# Altium schematic sheet Mosfets.SchDoc
size A4; SheetNumber: 6; SheetTotal: 6
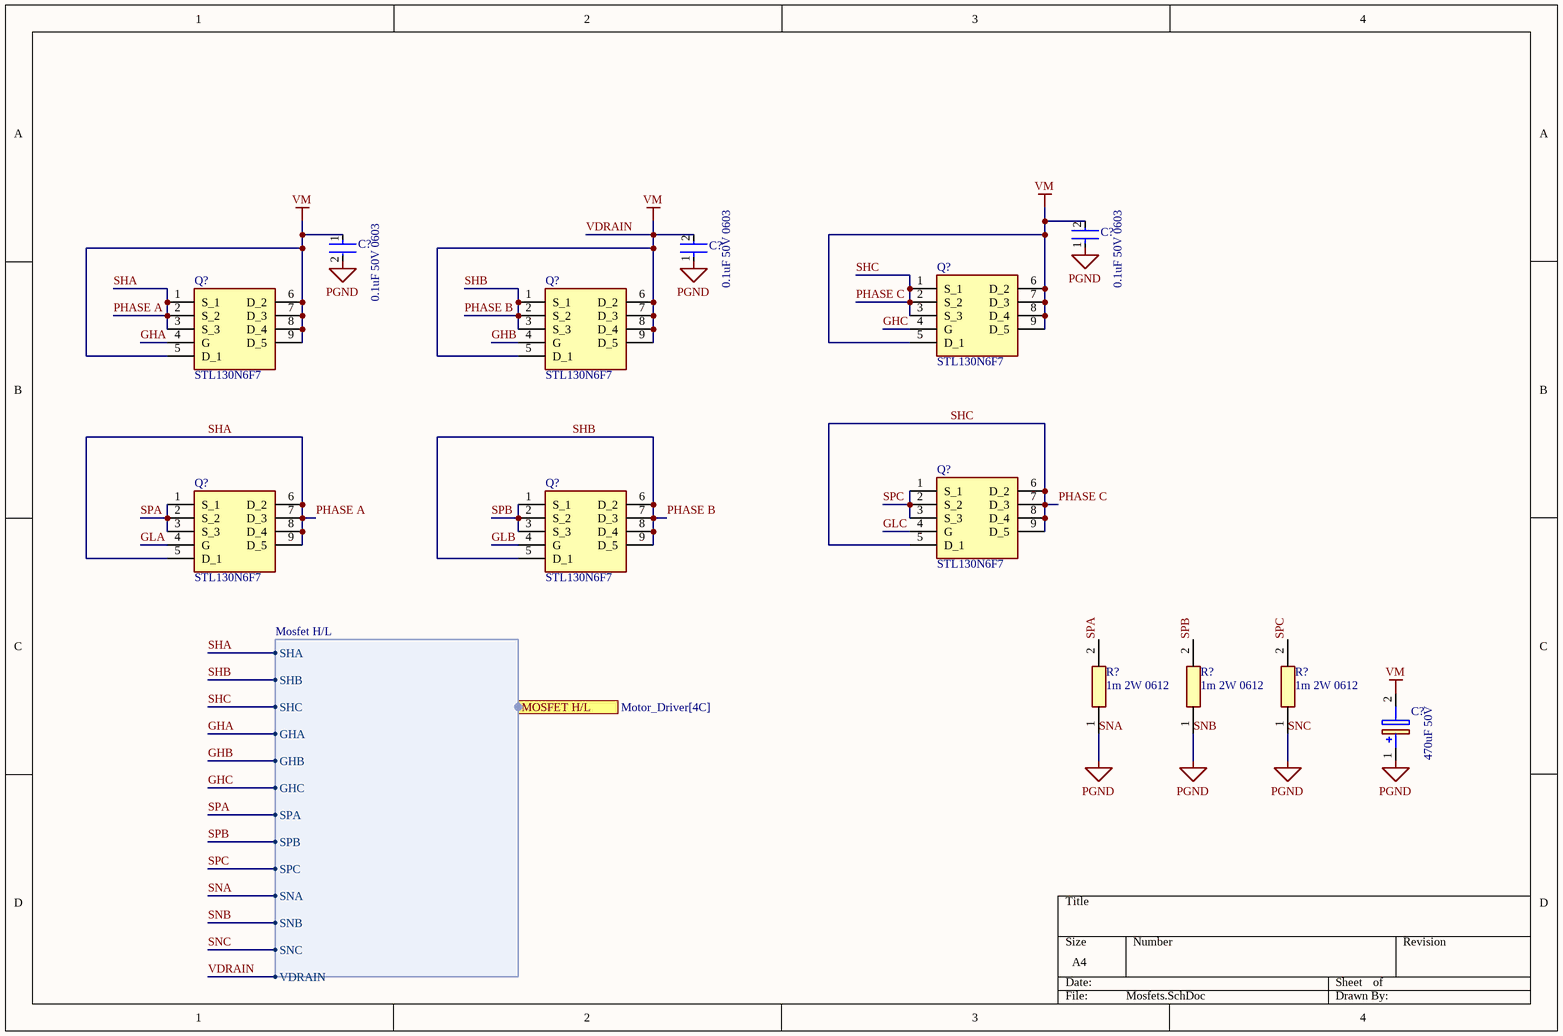
[diagram p0: Mosfets.SchDoc]

## Parts
(Parts that share a designator on the sheet are numbered #1, #2 ... from top to bottom, then left to right.)
C?#1  0.1uF 50V 0603  [FP-0603B104K500CT-IPC_C]
C?#2  0.1uF 50V 0603  [FP-0603B104K500CT-IPC_C]
C?#3  0.1uF 50V 0603  [FP-0603B104K500CT-IPC_C]
C?#4  470uF 50V  [CAPPRD500W65D1000H2200]
Q?#1  STL130N6F7  [FERD20U50DJFTR]
Q?#2  STL130N6F7  [FERD20U50DJFTR]
Q?#3  STL130N6F7  [FERD20U50DJFTR]
Q?#4  STL130N6F7  [FERD20U50DJFTR]
Q?#5  STL130N6F7  [FERD20U50DJFTR]
Q?#6  STL130N6F7  [FERD20U50DJFTR]
R?#1  1m 2W 0612  [WFCP06121L000FE66]
R?#2  1m 2W 0612  [WFCP06121L000FE66]
R?#3  1m 2W 0612  [WFCP06121L000FE66]

## Ports
MOSFET H/L (harness Mosfet H/L, see Motor_Driver[4C])

## Harnesses
Mosfet H/L: SHA, SHB, SHC, GHA, GHB, GHC, SPB, SPA, SPC, SNA, SNB, SNC, VDRAIN

## Nets
SNA: C?#1.2 C?#2.1 C?#3.1 C?#4.1(+) R?#1.1 R?#2.1 R?#3.1 ; port MOSFET H/L.SNA, port MOSFET H/L.SNB, port MOSFET H/L.SNC  [also labelled PGND, SNB, SNC]
VDRAIN: C?#1.1 C?#2.2 C?#3.2 C?#4.2(-) Q?#1.5(D_1) Q?#1.6(D_2) Q?#1.7(D_3) Q?#1.8(D_4) Q?#1.9(D_5) Q?#2.5(D_1) Q?#2.6(D_2) Q?#2.7(D_3) Q?#2.8(D_4) Q?#2.9(D_5) Q?#3.5(D_1) Q?#3.6(D_2) Q?#3.7(D_3) Q?#3.8(D_4) Q?#3.9(D_5) ; port MOSFET H/L.VDRAIN  [also labelled VM]
GHA: Q?#2.4(G) ; port MOSFET H/L.GHA
GHB: Q?#3.4(G) ; port MOSFET H/L.GHB
GHC: Q?#1.4(G) ; port MOSFET H/L.GHC
GLA: Q?#5.4(G)
GLB: Q?#6.4(G)
GLC: Q?#4.4(G)
PHASE A: Q?#2.1(S_1) Q?#2.2(S_2) Q?#2.3(S_3) Q?#5.5(D_1) Q?#5.6(D_2) Q?#5.7(D_3) Q?#5.8(D_4) Q?#5.9(D_5) ; port MOSFET H/L.SHA  [also labelled SHA]
PHASE B: Q?#3.1(S_1) Q?#3.2(S_2) Q?#3.3(S_3) Q?#6.5(D_1) Q?#6.6(D_2) Q?#6.7(D_3) Q?#6.8(D_4) Q?#6.9(D_5) ; port MOSFET H/L.SHB  [also labelled SHB]
PHASE C: Q?#1.1(S_1) Q?#1.2(S_2) Q?#1.3(S_3) Q?#4.5(D_1) Q?#4.6(D_2) Q?#4.7(D_3) Q?#4.8(D_4) Q?#4.9(D_5) ; port MOSFET H/L.SHC  [also labelled SHC]
SPA: Q?#5.1(S_1) Q?#5.2(S_2) Q?#5.3(S_3) R?#1.2 ; port MOSFET H/L.SPA
SPB: Q?#6.1(S_1) Q?#6.2(S_2) Q?#6.3(S_3) R?#2.2 ; port MOSFET H/L.SPB
SPC: Q?#4.1(S_1) Q?#4.2(S_2) Q?#4.3(S_3) R?#3.2 ; port MOSFET H/L.SPC

## Library data of the parts
C?#1-C?#3 = CMP-45632-000007-1: CAP CER 0.1UF 50V X7R 0603; Tolerance: 10%; Capacitance: 100nF; Radiation Hardening: No; Depth: 0.8mm; Length: 1.6mm; Voltage Rating: 50V; Dielectric: X7R; Case/Package: 0603; RoHS Compliant: Yes; Case Code (Metric): 1608; Voltage Rating (DC): 50V; Min Operating Temperature: -55°C; Series: -; Max Operating Temperature: 125°C; Lead Free: Lead Free; Case Code (Imperial): 0603; Packaging: Tape and Reel
C?#4 = ECA-1HM471B: Capacitor Polarised, ECA-1HM471B; Manufacturer_Name: Panasonic; Datasheet Link: http://industrial.panasonic.com/cdbs/www-data/pdf/RDF0000/ABA0000C1218.pdf; Height: 22mm; Manufacturer_Part_Number: ECA-1HM471B; Mouser Part Number: 667-ECA-1HM471B; Mouser Price/Stock: https://www.mouser.co.uk/ProductDetail/Panasonic/ECA-1HM471B?qs=RQTRNQENgbttVw3qXUS4Ew%3D%3D; Arrow Part Number: ECA-1HM471B; Arrow Price/Stock: https://www.arrow.com/en/products/eca-1hm471b/panasonic?utm_currency=USD&region=nac
Q?#1-Q?#6 = STL130N6F7: MOSFET (N-Channel); Manufacturer_Name: STMicroelectronics; Datasheet Link: https://www.st.com/resource/en/datasheet/stl130n6f7.pdf; Height: 1mm; Manufacturer_Part_Number: STL130N6F7; Mouser Part Number: 511-STL130N6F7; Mouser Price/Stock: https://www.mouser.co.uk/ProductDetail/STMicroelectronics/STL130N6F7?qs=bKenfurwlsn66DUeXqgWIw%3D%3D; Arrow Part Number: STL130N6F7; Arrow Price/Stock: https://www.arrow.com/en/products/stl130n6f7/stmicroelectronics?utm_currency=USD&region=nac
R?#1-R?#3 = WFCP06121L000FE66: Resistor; Manufacturer_Name: Vishay; Datasheet Link: https://www.vishay.com/docs/30417/wfcp.pdf; Height: 1mm; Manufacturer_Part_Number: WFCP06121L000FE66; Mouser Part Number: 71-WFCP06121L000FE66; Mouser Price/Stock: https://www.mouser.co.uk/ProductDetail/Vishay-Dale/WFCP06121L000FE66?qs=Li%252BoUPsLEnsMoGHMrspCzw%3D%3D; Arrow Part Number: WFCP06121L000FE66; Arrow Price/Stock: https://www.arrow.com/en/products/wfcp06121l000fe66/vishay?utm_currency=USD&region=nac